# Altium schematic sheet Power_MCU.SchDoc
size A4; SheetNumber: 3
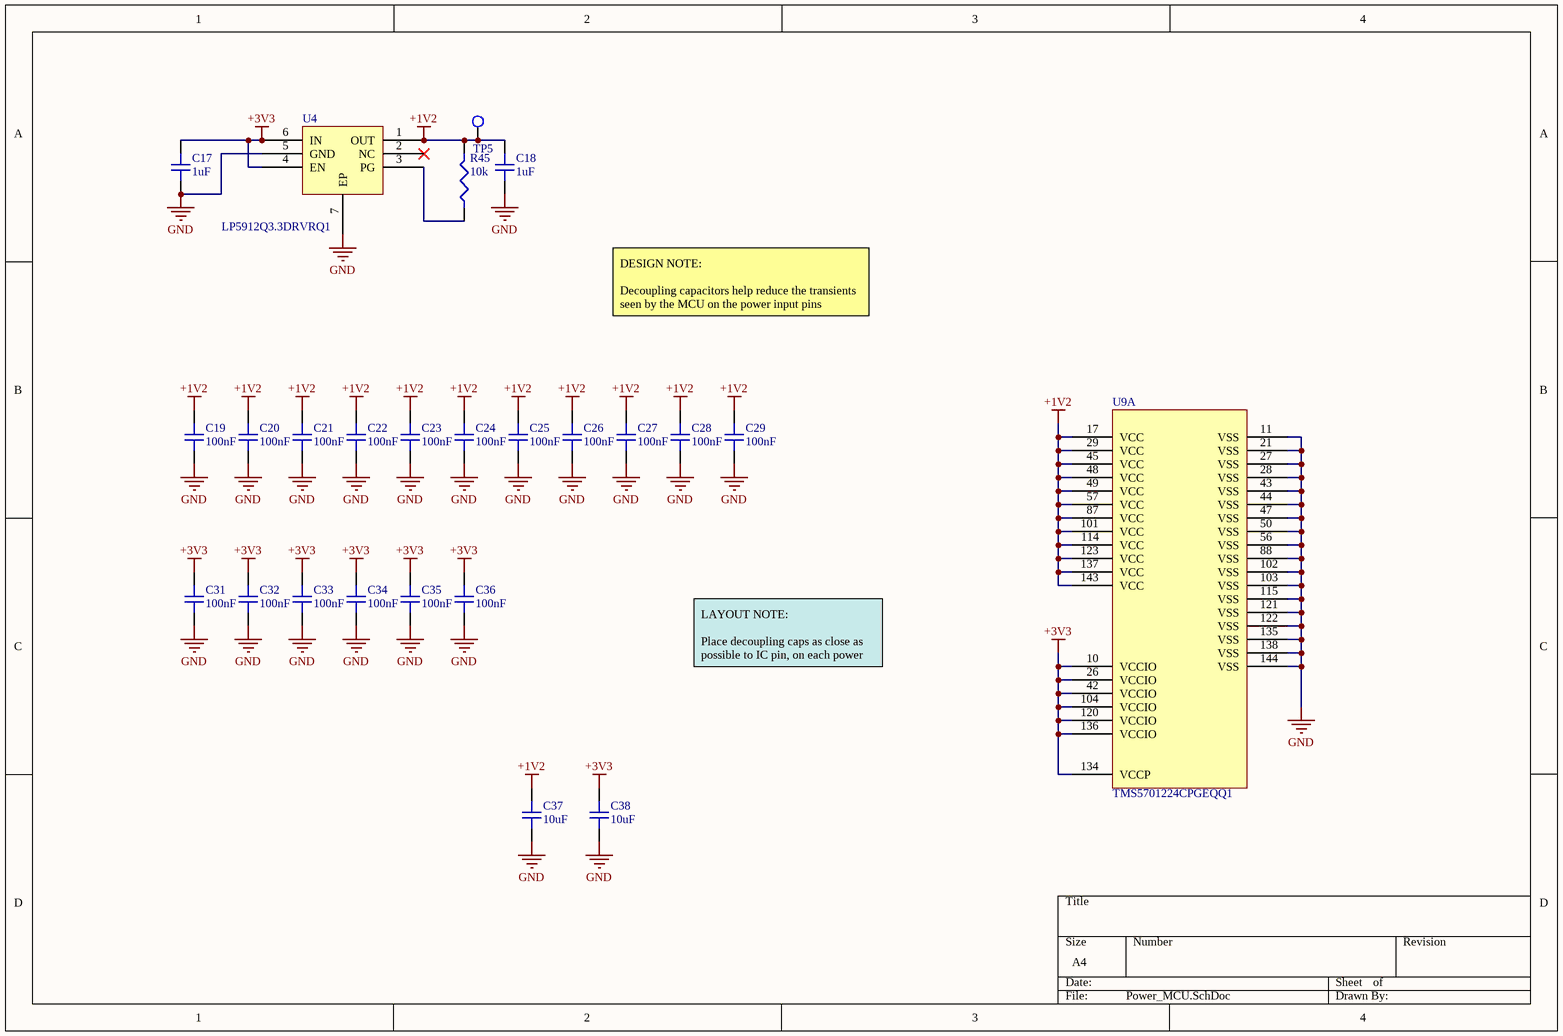
[diagram p0: Power_MCU.SchDoc]

## Parts
C17  1uF  [C0805]
C18  1uF  [C0805]
C19  100nF  [C0805]
C20  100nF  [C0805]
C21  100nF  [C0805]
C22  100nF  [C0805]
C23  100nF  [C0805]
C24  100nF  [C0805]
C25  100nF  [C0805]
C26  100nF  [C0805]
C27  100nF  [C0805]
C28  100nF  [C0805]
C29  100nF  [C0805]
C31  100nF  [C0805]
C32  100nF  [C0805]
C33  100nF  [C0805]
C34  100nF  [C0805]
C35  100nF  [C0805]
C36  100nF  [C0805]
C37  10uF  [TANT_10u]
C38  10uF  [TANT_10u]
R45  10k  [R0805]
TP5  5015  [TP_HOOK]  (value not drawn)
U4  LP5912Q3.3DRVRQ1  [WSON]
U9  TMS5701224CPGEQQ1  [LQFP-144]  (part A of 3)

## Nets
+1V2: C18.2 C19.2 C20.2 C21.2 C22.2 C23.2 C24.2 C25.2 C26.2 C27.2 C28.2 C29.2 C37.2 R45.2 TP5.1 U4.1(OUT) U9.17(VCC) U9.29(VCC) U9.45(VCC) U9.48(VCC) U9.49(VCC) U9.57(VCC) U9.87(VCC) U9.101(VCC) U9.114(VCC) U9.123(VCC) U9.137(VCC) U9.143(VCC)
+3V3: C17.2 C31.2 C32.2 C33.2 C34.2 C35.2 C36.2 C38.2 U4.4(EN) U4.6(IN) U9.10(VCCIO) U9.26(VCCIO) U9.42(VCCIO) U9.104(VCCIO) U9.120(VCCIO) U9.134(VCCP) U9.136(VCCIO)
GND: C17.1 C18.1 C19.1 C20.1 C21.1 C22.1 C23.1 C24.1 C25.1 C26.1 C27.1 C28.1 C29.1 C31.1 C32.1 C33.1 C34.1 C35.1 C36.1 C37.1 C38.1 U4.5(GND) U4.7(EP) U9.11(VSS) U9.21(VSS) U9.27(VSS) U9.28(VSS) U9.43(VSS) U9.44(VSS) U9.47(VSS) U9.50(VSS) U9.56(VSS) U9.88(VSS) U9.102(VSS) U9.103(VSS) U9.115(VSS) U9.121(VSS) U9.122(VSS) U9.135(VSS) U9.138(VSS) U9.144(VSS)
NetR45_1: R45.1 U4.3(PG)

Not connected (* = marked no-connect by the designer): U4 2(NC)*

## Notes on the sheet
- DESIGN NOTE:
  Decoupling capacitors help reduce the transients seen by the MCU on the power input pins
- LAYOUT NOTE:
  Place decoupling caps as close as possible to IC pin, on each power pin

## Library data of the parts
C17 C18 = 0805ZC105KAT2A: CAP CER 1UF 10V X7R 0805; Manufacturer: Kyocera AVX; Tolerance: 10%; Dissipation Factor: 5%; Insulation Resistance: 100GR; Supplier 1: Digi-Key; Manufacturer Part Number: 0805ZC105KAT2A; Stock 1: 385183; Pricing 1: 1=0.21, 10=0.147, 100=0.069, 500=0.0484, 1000=0.0401 (USD); Mount: Surface Mount,PCB; Case/Package: 0805; Number of Pins: 2; Case Code (Imperial): 0805; Case Code (Metric): 2012; Contact Plating: Tin,Matte; Min Operating Temperature: -55°C; Max Operating Temperature: 125°C; Capacitance: 1uF; Voltage Rating: 10V; Voltage Rating (DC): 10V; Packaging: Tape and Reel; Package Quantity: 1; Dielectric: X7R; Termination: SMD/SMT; Voltage: 10V; Length: 2.01mm; Height: 1.4mm; Width: 1.25mm; Thickness: 0.055inch; Depth: 1.25mm; Radiation Hardening: No; REACH SVHC: No SVHC; Lead Free: Lead Free; ComponentLink1URL: https://datasheet.ciiva.com/2988/cx7r-2988071.pdf; ComponentLink1Description: https://datasheet.ciiva.com/2988/cx7r-2988071.pdf; ComponentLink2URL: https://datasheet.ciiva.com/2988/cx7r-2988072.pdf; ComponentLink2Description: https://datasheet.ciiva.com/2988/cx7r-2988072.pdf; ComponentLink3URL: https://datasheet.ciiva.com/14601/70001075-14601048.pdf; ComponentLink3Description: https://datasheet.ciiva.com/14601/70001075-14601048.pdf; ComponentLink4URL: https://datasheet.ciiva.com/14594/70001075-14594329.pdf; ComponentLink4Description: https://datasheet.ciiva.com/14594/70001075-14594329.pdf; ComponentLink5URL: https://datasheet.ciiva.com/25901/cx7r-25901193.pdf; ComponentLink5Description: https://datasheet.ciiva.com/25901/cx7r-25901193.pdf; ComponentLink6URL: https://datasheet.ciiva.com/15165/getdatasheetpartid-71567-15165451.pdf; ComponentLink6Description: https://datasheet.ciiva.com/15165/getdatasheetpartid-71567-15165451.pdf; ComponentLink7URL: https://datasheet.ciiva.com/151/cx7r-151916.pdf; ComponentLink7Description: https://datasheet.ciiva.com/151/cx7r-151916.pdf; ComponentLink8URL: https://datasheet.ciiva.com/151/cx7r-151917.pdf; ComponentLink8Description: https://datasheet.ciiva.com/151/cx7r-151917.pdf; ComponentLink9URL: https://datasheet.ciiva.com/151/cx7r-151918.pdf; ComponentLink9Description: https://datasheet.ciiva.com/151/cx7r-151918.pdf; ComponentLink10URL: https://datasheet.ciiva.com/11787/0900766b80ed4be2-11787102.pdf; ComponentLink10Description: https://datasheet.ciiva.com/11787/0900766b80ed4be2-11787102.pdf; ComponentLink11URL: https://datasheet.ciiva.com/7812/84526-7812223.pdf; ComponentLink11Description: https://datasheet.ciiva.com/7812/84526-7812223.pdf; ComponentLink12URL: https://datasheet.ciiva.com/19475/2011248-19475855.pdf; ComponentLink12Description: https://datasheet.ciiva.com/19475/2011248-19475855.pdf; Supplier Part Number 1: 478-1405-1-ND
C19-C29 C31-C36 = GRM21B7U1A104JA01L: MLCC SMD CAP 100nF 10Volts U2J 5%; Manufacturer: Murata; Voltage Rating: 10V; Supplier 1: Digi-Key; Manufacturer Part Number: GRM21B7U1A104JA01L; Stock 1: 6000; Pricing 1: 1=0.46, 10=0.32, 100=0.192, 500=0.144, 1000=0.1216 (USD); Mount: Surface Mount; Case/Package: 0805; Case Code (Imperial): 0805; Case Code (Metric): 2012; Min Operating Temperature: -55°C; Max Operating Temperature: 125°C; Capacitance: 100nF; Voltage Rating (DC): 10V; Tolerance: 5%; Packaging: Tape and Reel; Package Quantity: 3000; Dielectric: U2J; Termination: SMD/SMT; Length: 2mm; Height: 1.25mm; Width: 0.049inch; Thickness: 0.053inch; Depth: 1.25mm; Radiation Hardening: No; ComponentLink1URL: https://datasheet.ciiva.com/5424/product-5424660.pdf; ComponentLink1Description: https://datasheet.ciiva.com/5424/product-5424660.pdf; ComponentLink2URL: https://datasheet.ciiva.com/17451/product-17451845.pdf; ComponentLink2Description: https://datasheet.ciiva.com/17451/product-17451845.pdf; ComponentLink3URL: https://datasheet.ciiva.com/11618/product-11618924.pdf; ComponentLink3Description: https://datasheet.ciiva.com/11618/product-11618924.pdf; Supplier Part Number 1: 490-11592-6-ND
C37 C38 = F381A106MMA: AVX   F381A106MMA   Surface Mount Tantalum Capacitor, F38 Series, 10 F, 0603 [1608 Metric], 0.5 ohm, 10 V; Manufacturer: Kyocera AVX; Tolerance: 20%; ESR (Equivalent Series Resistance): 500mR; Voltage Rating: 10V; Life (Hours): 1000Hour; Dissipation Factor: 15%; Leakage Current: 10uA; Supplier 1: Digi-Key; Manufacturer Part Number: F381A106MMA; Stock 1: 7989; Pricing 1: 1=0.75, 10=0.551, 100=0.3779, 500=0.2992, 1000=0.2519 (USD); Case/Package: 0603; Weight: 7.1E-05oz; Case Code (Metric): 1608; Case Code (Imperial): 0603; Min Operating Temperature: -55°C; Max Operating Temperature: 105°C; Capacitance: 10uF; Packaging: Tape and Reel; Termination: SMD/SMT; Package Quantity: 4000; Voltage Rating (DC): 10V; Length: 1.6mm; Height: 0.8mm; Width: 0.033inch; Height - Seated (Max): 0.035inch; Depth: 0.85mm; Radiation Hardening: No; REACH SVHC: No SVHC; ComponentLink1URL: https://datasheet.ciiva.com/48510/f38-48510901.pdf; ComponentLink1Description: https://datasheet.ciiva.com/48510/f38-48510901.pdf; ComponentLink2URL: https://datasheet.ciiva.com/46417/1805432-46417517.pdf; ComponentLink2Description: https://datasheet.ciiva.com/46417/1805432-46417517.pdf; ComponentLink3URL: https://datasheet.ciiva.com/46417/1805432-46417518.pdf; ComponentLink3Description: https://datasheet.ciiva.com/46417/1805432-46417518.pdf; Supplier Part Number 1: 478-9527-1-ND
R45 = RC0805FR-071KL: RES SMD 10K OHM 1% 1/8W 0805; Manufacturer: Yageo Phycomp; Temperature Coefficient: 100ppm/°C; Resistance: 1KR; Voltage Rating (DC): 150V; Power Rating: 125mW; Supplier 1: Digi-Key; Manufacturer Part Number: RC0805FR-071KL; Stock 1: 5527973; Pricing 1: 1=0.1, 10=0.022, 100=0.0088, 1000=0.004, 2500=0.0034 (USD); Case/Package: 0805; Number of Pins: 2; Min Operating Temperature: -55°C; Max Operating Temperature: 155°C; Tolerance: 1%; Packaging: Cut Tape; Length: 2mm; Height: 0.5mm; Width: 1.25mm; Depth: 1.25mm; REACH SVHC: No SVHC; Lead Free: Lead Free
TP5 = 5015: TEST POINT, PCB, SMT; Manufacturer: Keystone Electronics; Number of Ports: 1; Supplier 1: Digi-Key; Manufacturer Part Number: 5015; Stock 1: 1937775; Pricing 1: 1=0.44, 10=0.421, 25=0.3604, 50=0.3064, 100=0.2944, 250=0.2644, 500=0.2524 (USD); Mount: Surface Mount; Colour: White; Contact Material: Bronze; Contact Plating: Tin,Silver,Lead; Material: Bronze,Silver; Package Quantity: 1; Packaging: Tape and Reel; Termination: Solder; Orientation: Straight; Length: 2.66mm; Height: 0.06inch; Thickness: 0.01inch; Depth: 1.01mm; REACH SVHC: No SVHC; Lead Free: Lead Free; ComponentLink1URL: https://datasheet.ciiva.com/2917/5015-2917616.pdf; ComponentLink1Description: https://datasheet.ciiva.com/2917/5015-2917616.pdf; ComponentLink2URL: https://datasheet.ciiva.com/2917/5015-2917617.pdf; ComponentLink2Description: https://datasheet.ciiva.com/2917/5015-2917617.pdf; ComponentLink3URL: https://datasheet.ciiva.com/1123/5015-1123862.pdf; ComponentLink3Description: https://datasheet.ciiva.com/1123/5015-1123862.pdf; ComponentLink4URL: https://datasheet.ciiva.com/16883/70182998-16883734.pdf; ComponentLink4Description: https://datasheet.ciiva.com/16883/70182998-16883734.pdf; Supplier Part Number 1: 36-5015CT-ND
U4 = LP5912Q3.3DRVRQ1: IC REG LDO 3.3V 0.5A; Manufacturer: Texas Instruments; Quiescent Current: 30uA; Dropout Voltage: 150mV; Supplier 1: Digi-Key; Manufacturer Part Number: LP5912Q3.3DRVRQ1; Stock 1: 10415; Pricing 1: 1=1.41, 10=1.261, 100=0.9831, 500=0.8122, 1000=0.6412 (USD); Min Operating Temperature: -40°C; Max Operating Temperature: 125°C; Lead Free: Lead Free; ComponentLink1URL: http://www.ti.com/lit/ds/symlink/lp5912-q1.pdf; ComponentLink1Description: http://www.ti.com/lit/ds/symlink/lp5912-q1.pdf; Supplier Part Number 1: 296-44294-1-ND
U9 = TMS5701224CPGEQQ1: ARM CORTEX R4 LOCK STEP HERCULES MCU; Manufacturer: Texas Instruments; Frequency: 160MHz; Interface: I2C,SPI,CAN,UART,USART,LIN,SCI,EBI/EMI; Number of I/Os: 64; Oscillator Type: External; RAM Size: 192KB; Number of Timers/Counters: 2; Watchdog Timer: Yes; Memory Type: FLASH; Memory Size: 1.25MB; Density: 1310720B; Peripherals: POR,PWM,WDT,DMA; Supplier 1: Digi-Key; Manufacturer Part Number: TMS5701224CPGEQQ1; Stock 1: 113; Pricing 1: 1=22.12, 10=20.402, 100=17.4222, 500=15.8176 (USD); Case/Package: LQFP; Number of Pins: 144; Min Operating Temperature: -40°C; Max Operating Temperature: 125°C; Packaging: Tray; Number of Programmable I/O: 64; Max Frequency: 160MHz; Number of GPIO: 64; Core Architecture: ARM; Lead Free: Lead Free; ComponentLink1URL: http://www.ti.com/lit/pdf/spnu515; ComponentLink1Description: http://www.ti.com/lit/pdf/spnu515; ComponentLink2URL: http://www.ti.com/lit/gpn/tms570ls1224; ComponentLink2Description: http://www.ti.com/lit/gpn/tms570ls1224; ComponentLink3URL: http://www.ti.com/general/docs/lit/getliterature.tsp?genericPartNumber=TMS570LS1224&&fileType=pdf; ComponentLink3Description: http://www.ti.com/general/docs/lit/getliterature.tsp?genericPartNumber=TMS570LS1224&&fileType=pdf; Supplier Part Number 1: 296-47200-ND